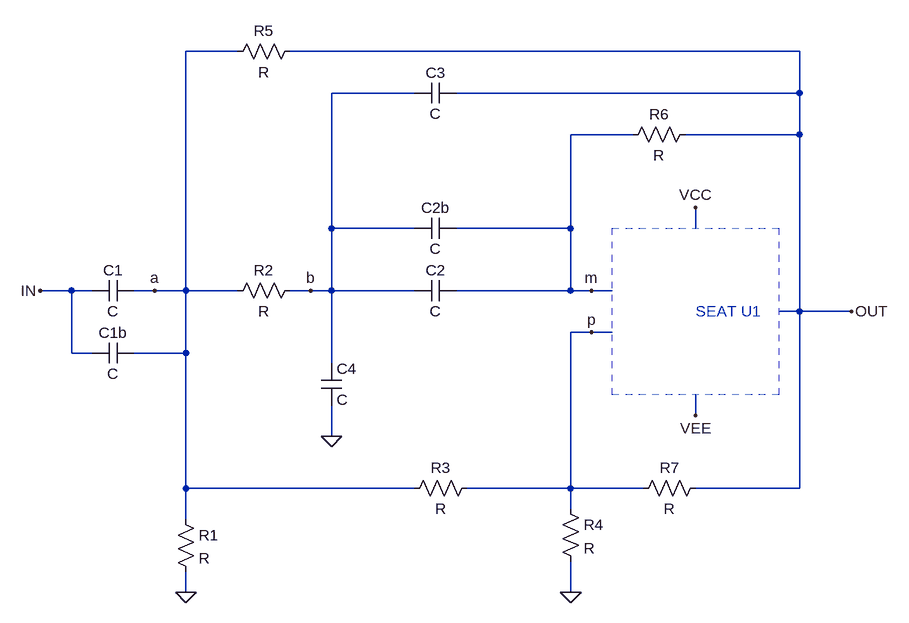
[diagram p0: schematic MFB_HPn2.asc]
MFB_HPn2.asc, the LTspice schematic file:
Version 4.1
SHEET 1 2076 708
WIRE -400 -144 -480 -144
WIRE 464 -144 -320 -144
WIRE -128 -80 -256 -80
WIRE 464 -80 464 -144
WIRE 464 -80 -64 -80
WIRE 208 -16 112 -16
WIRE 464 -16 464 -80
WIRE 464 -16 288 -16
WIRE -256 128 -256 -80
WIRE -128 128 -256 128
WIRE 112 128 112 -16
WIRE 112 128 -64 128
WIRE 304 128 304 96
WIRE 112 224 112 128
WIRE -656 224 -704 224
WIRE -624 224 -656 224
WIRE -528 224 -560 224
WIRE -480 224 -480 -144
WIRE -480 224 -528 224
WIRE -400 224 -480 224
WIRE -288 224 -320 224
WIRE -256 224 -256 128
WIRE -256 224 -288 224
WIRE -128 224 -256 224
WIRE 112 224 -64 224
WIRE 144 224 112 224
WIRE 176 224 144 224
WIRE 464 256 464 -16
WIRE 464 256 432 256
WIRE 544 256 464 256
WIRE 144 288 112 288
WIRE 176 288 144 288
WIRE -656 320 -656 224
WIRE -624 320 -656 320
WIRE -480 320 -480 224
WIRE -480 320 -560 320
WIRE -256 336 -256 224
WIRE 304 416 304 384
WIRE -256 448 -256 400
WIRE -480 528 -480 320
WIRE -128 528 -480 528
WIRE 112 528 112 288
WIRE 112 528 -48 528
WIRE 224 528 112 528
WIRE 464 528 464 256
WIRE 464 528 304 528
WIRE 112 560 112 528
WIRE -480 576 -480 528
WIRE -480 688 -480 656
WIRE 112 688 112 640
FLAG 544 256 OUT
FLAG 304 96 VCC
FLAG 304 416 VEE
FLAG 144 224 m
FLAG 144 288 p
FLAG -528 224 a
FLAG -704 224 IN
FLAG -288 224 b
FLAG 112 688 0
FLAG -480 688 0
FLAG -256 448 0
SYMBOL res -496 560 R0
SYMATTR InstName R1
SYMBOL res -304 208 R90
WINDOW 0 0 56 VBottom 2
WINDOW 3 32 56 VTop 2
SYMATTR InstName R2
SYMBOL res 304 -32 R90
WINDOW 0 0 56 VBottom 2
WINDOW 3 32 56 VTop 2
SYMATTR InstName R6
SYMBOL res 96 544 R0
SYMATTR InstName R4
SYMBOL res 320 512 R90
WINDOW 0 0 56 VBottom 2
WINDOW 3 32 56 VTop 2
SYMATTR InstName R7
SYMBOL cap -560 208 R90
WINDOW 0 0 32 VBottom 2
WINDOW 3 32 32 VTop 2
SYMATTR InstName C1
SYMBOL cap -64 208 R90
WINDOW 0 0 32 VBottom 2
WINDOW 3 32 32 VTop 2
SYMATTR InstName C2
SYMBOL cap -64 -96 R90
WINDOW 0 0 32 VBottom 2
WINDOW 3 32 32 VTop 2
SYMATTR InstName C3
SYMBOL cap -560 304 R90
WINDOW 3 32 32 VTop 2
WINDOW 0 0 32 VBottom 2
SYMATTR InstName C1b
SYMBOL cap -64 112 R90
WINDOW 0 0 32 VBottom 2
WINDOW 3 32 32 VTop 2
SYMATTR InstName C2b
SYMBOL res -32 512 R90
WINDOW 0 0 56 VBottom 2
WINDOW 3 32 56 VTop 2
SYMATTR InstName R3
SYMBOL cap -272 336 R0
SYMATTR InstName C4
SYMBOL res -304 -160 R90
WINDOW 0 0 56 VBottom 2
WINDOW 3 32 56 VTop 2
SYMATTR InstName R5
TEXT 304 256 Left 2 ;SEAT U1
RECTANGLE Normal 176 128 432 384 2

The netlist it stands for:
* MFB_HPn2.asc
R1 a 0 R
R2 b a R
R6 OUT m R
R4 p 0 R
R7 OUT p R
C1 a IN C
C2 m b C
C3 OUT b C
C1b a IN C
C2b m b C
R3 p a R
C4 b 0 C
R5 OUT a R
* SEAT U1
.backanno
.end